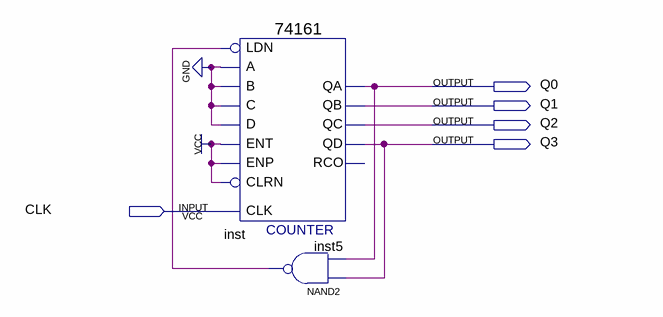
[diagram p0: schematic sheet]
// Quartus schematic lab7.bdf as structural Verilog: 2 symbols, 5 pins
module lab7 (
  input  CLK,
  output Q0,
  output Q1,
  output Q2,
  output Q3
);

  wire inst5_out;

  \74161  inst (
    .CLRN(1'b1), .CLK(CLK), .ENP(1'b1), .LDN(inst5_out), .A(1'b0), .D(1'b0), .ENT(1'b1), .B(1'b0), .C(1'b0),
    .QD(Q3), .QC(Q2), .QB(Q1), .QA(Q0));  // open: RCO
  nand inst5 (inst5_out, Q3, Q0);
endmodule
